# Altium schematic sheet Contactor_Switching.SchDoc
size A4; DocumentNumber: 7; SheetNumber: 7; SheetTotal: 8
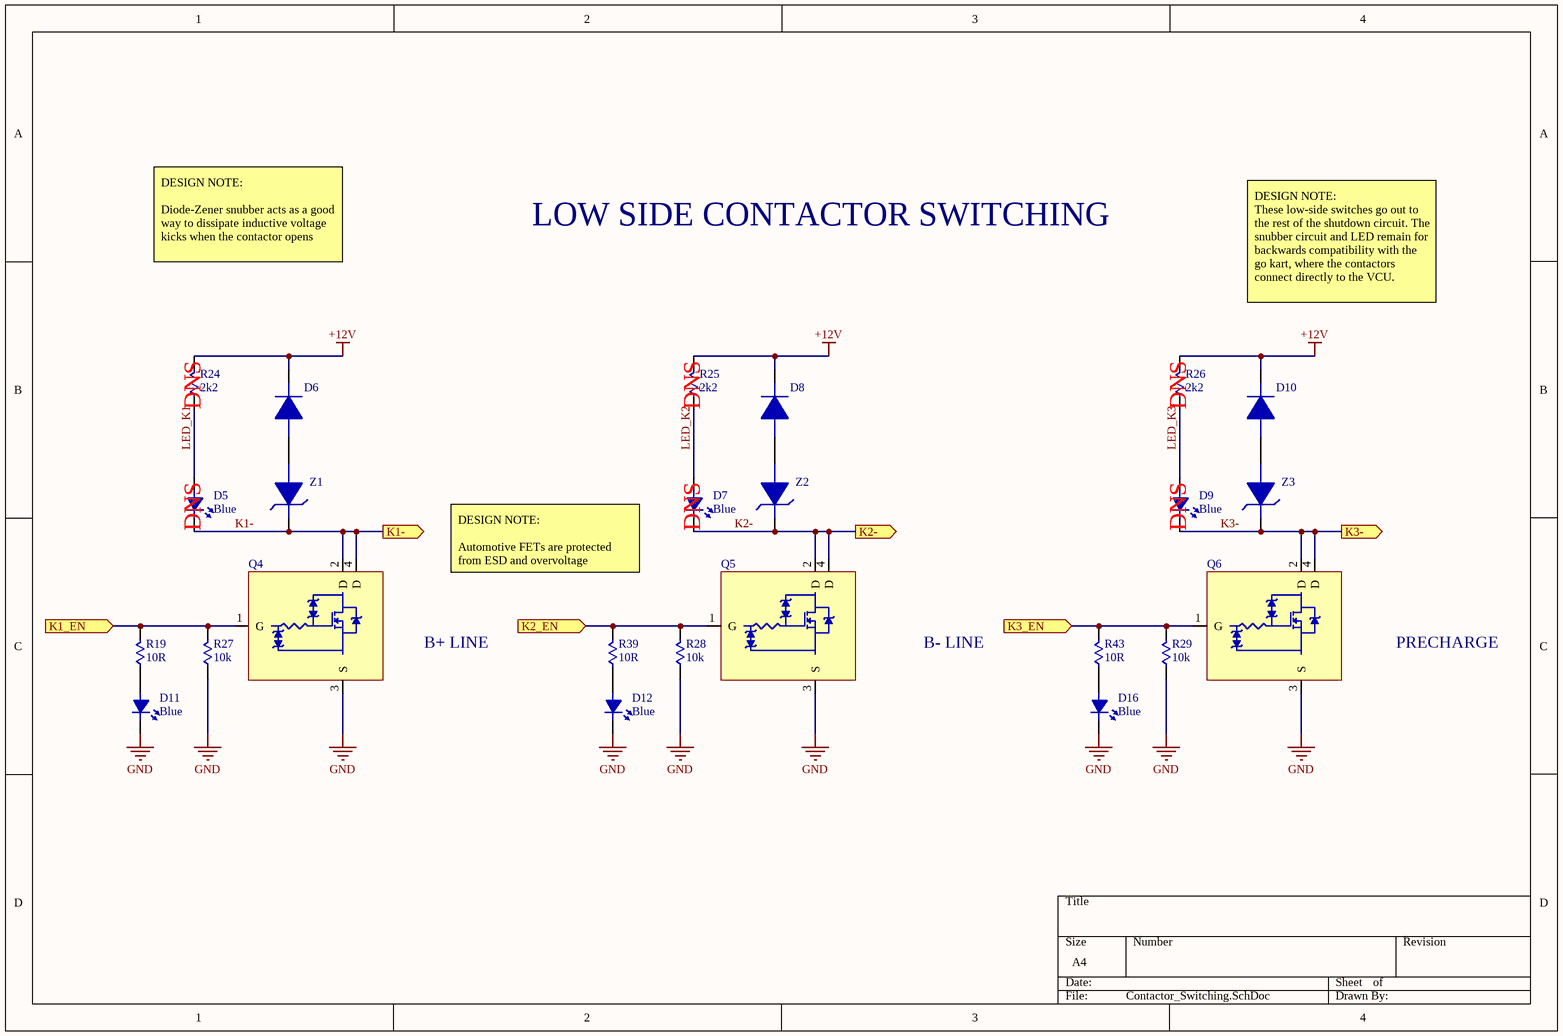
[diagram p0: Contactor_Switching.SchDoc]

## Parts
D5  Blue  [LED_0603]
D6  S3BB-TP  [DO-214AA_Diode]  (value not drawn)
D7  Blue  [LED_0603]
D8  S3BB-TP  [DO-214AA_Diode]  (value not drawn)
D9  Blue  [LED_0603]
D10  S3BB-TP  [DO-214AA_Diode]  (value not drawn)
D11  Blue  [LED_0603]
D12  Blue  [LED_0603]
D16  Blue  [LED_0603]
Q4  NCV8406ASTT1G  [SOT-223_NFET]  (value not drawn)
Q5  NCV8406ASTT1G  [SOT-223_NFET]  (value not drawn)
Q6  NCV8406ASTT1G  [SOT-223_NFET]  (value not drawn)
R19  10R  [R0402]
R24  2k2  [R0402]
R25  2k2  [R0402]
R26  2k2  [R0402]
R27  10k  [R0402]
R28  10k  [R0402]
R29  10k  [R0402]
R39  10R  [R0402]
R43  10R  [R0402]
Z1  12V  [DO-214AA_Diode]  (value not drawn)
Z2  12V  [DO-214AA_Diode]  (value not drawn)
Z3  12V  [DO-214AA_Diode]  (value not drawn)

## Ports
K1-, K1_EN, K2-, K2_EN, K3-, K3_EN

## Nets
+12V: D6.2 D8.2 D10.2 R24.2 R25.2 R26.2
GND: D11.2 D12.2 D16.2 Q4.3(S) Q5.3(S) Q6.3(S) R27.1 R28.1 R29.1
K1-: D5.2 Q4.2(D) Q4.4(D) Z1.2 ; port K1-
K1_EN: Q4.1(G) R19.2 R27.2 ; port K1_EN
K2-: D7.2 Q5.2(D) Q5.4(D) Z2.2 ; port K2-
K2_EN: Q5.1(G) R28.2 R39.2 ; port K2_EN
K3-: D9.2 Q6.2(D) Q6.4(D) Z3.2 ; port K3-
K3_EN: Q6.1(G) R29.2 R43.2 ; port K3_EN
LED_K1: D5.1 R24.1
LED_K2: D7.1 R25.1
LED_K3: D9.1 R26.1
NetD6_1: D6.1 Z1.1
NetD8_1: D8.1 Z2.1
NetD10_1: D10.1 Z3.1
NetD11_1: D11.1 R19.1
NetD12_1: D12.1 R39.1
NetD16_1: D16.1 R43.1

## Notes on the sheet
- LOW SIDE CONTACTOR SWITCHING
- DESIGN NOTE:
  Diode-Zener snubber acts as a good way to dissipate inductive voltage kicks when the contactor opens
- DESIGN NOTE:
  These low-side switches go out to the rest of the shutdown circuit. The snubber circuit and LED remain for backwards compatibility with the go kart, where the contactors connect directly to the VCU.
- (near R24) DNS
- (near R25) DNS
- (near R26) DNS
- (near D5) DNS
- DESIGN NOTE:
  Automotive FETs are protected from ESD and overvoltage
- (near D7) DNS
- (near D9) DNS
- B+ LINE
- B- LINE
- PRECHARGE

## Library data of the parts
D5 D7 D9 D11 D12 D16 = 150060BS75000: LED BLUE CLEAR 0603 SMD 3.2V 145MCD, 470NM; Manufacturer: Wurth Electronics; Forward Current: 30mA; Viewing Angle: 140°; Lens Style: Clear,Rectangular; Test Current: 20mA; Supplier 1: Digi-Key; Manufacturer Part Number: 150060BS75000; Stock 1: 59667; Pricing 1: 1=0.15, 50=0.141, 100=0.121, 500=0.104 (USD); Mount: Surface Mount; Case/Package: 0603; Color: Blue; Case Code (Metric): 1608; Case Code (Imperial): 0603; Min Operating Temperature: -40°C; Max Operating Temperature: 85°C; Luminous Intensity: 145mcd; Forward Voltage: 3.2V; Wavelength: 470nm; Package Quantity: 4000; Packaging: Cut Tape; Dominant Wavelength: 470nm; Length: 1.6mm; Height: 0.7mm; Width: 0.8mm; REACH SVHC: Unknown; ComponentLink1URL: https://www.distrelec.biz/Web/Downloads/_t/ds/150060BS75000_eng_tds.pdf?mime=application%2Fpdf; ComponentLink1Description: https://www.distrelec.biz/Web/Downloads/_t/ds/150060BS75000_eng_tds.pdf?mime=application%2Fpdf; ComponentLink2URL: https://katalog.we-online.de/led/datasheet/150060BS75000.pdf; ComponentLink2Description: https://katalog.we-online.de/led/datasheet/150060BS75000.pdf; ComponentLink3URL: http://www.farnell.com/datasheets/1911343.pdf; ComponentLink3Description: http://www.farnell.com/datasheets/1911343.pdf; ComponentLink4URL: http://www.produktinfo.conrad.com/datenblaetter/750000-774999/759426-da-01-en-CHIPLED_0603_W_KL_BLAU_150060BS75000.pdf; ComponentLink4Description: http://www.produktinfo.conrad.com/datenblaetter/750000-774999/759426-da-01-en-CHIPLED_0603_W_KL_BLAU_150060BS75000.pdf; Supplier Part Number 1: 732-4966-1-ND
D6 D8 D10 = S3BB-TP: DIODE GEN PURP 100V 3A DO214AA; Manufacturer: MCC; Max Surge Current: 100A; Forward Voltage: 1.15V; Peak Reverse Current: 10uA; Element Configuration: Single; Supplier 1: Digi-Key; Manufacturer Part Number: S3BB-TP; Stock 1: 10943; Pricing 1: 1=0.56, 10=0.441, 25=0.372, 100=0.3028, 250=0.2509, 500=0.2076, 1000=0.1557 (USD); Mount: Surface Mount; Number of Pins: 2; Packaging: Tape and Reel; Package Quantity: 1; Reverse Voltage (DC): 100V; Average Rectified Current: 3A; Peak Non-Repetitive Surge Current: 100A; Max Repetitive Reverse Voltage (Vrrm): 100V; Radiation Hardening: No; Lead Free: Lead Free; ComponentLink1URL: https://datasheet.ciiva.com/914/s3ab-s3mbsmb-914278.pdf; ComponentLink1Description: https://datasheet.ciiva.com/914/s3ab-s3mbsmb-914278.pdf; ComponentLink2URL: https://datasheet.ciiva.com/914/s3ab-s3mbsmb-914279.pdf; ComponentLink2Description: https://datasheet.ciiva.com/914/s3ab-s3mbsmb-914279.pdf; ComponentLink3URL: https://datasheet.ciiva.com/914/s3ab-s3mbsmb-914280.pdf; ComponentLink3Description: https://datasheet.ciiva.com/914/s3ab-s3mbsmb-914280.pdf; ComponentLink4URL: https://datasheet.ciiva.com/15200/getdatasheetpartid-686538-15200554.pdf; ComponentLink4Description: https://datasheet.ciiva.com/15200/getdatasheetpartid-686538-15200554.pdf; ComponentLink5URL: https://datasheet.ciiva.com/17437/s3ab-s3mbsmb-17437836.pdf; ComponentLink5Description: https://datasheet.ciiva.com/17437/s3ab-s3mbsmb-17437836.pdf; Supplier Part Number 1: S3BB-TPMSCT-ND
Q4-Q6 = NCV8406ASTT1G: MOSFET Self-Protected Low Side Driver Automotive 4-Pin(3+Tab) SOT-223 T/R; Manufacturer: ON Semiconductor; Number of Outputs: 1; Max Output Current: 7A; Interface: On/Off; On-State Resistance: 210mR; Fault Protection: Over Voltage,Over Temperature; Supplier 1: Digi-Key; Manufacturer Part Number: NCV8406ASTT1G; Stock 1: 277; Pricing 1: 1=1.41, 10=1.258, 100=0.981, 500=0.8104 (USD); Mount: Surface Mount; Case/Package: TO-261-4; Number of Pins: 4; Min Operating Temperature: -40°C; Max Operating Temperature: 150°C; Packaging: Tape and Reel; Package Quantity: 1000; Length: 6.5mm; Height: 1.57mm; Radiation Hardening: No; Lead Free: Lead Free; Halogen Free: Halogen Free; ComponentLink1URL: https://datasheet.ciiva.com/15265/htmls5-15265281.pdf; ComponentLink1Description: https://datasheet.ciiva.com/15265/htmls5-15265281.pdf; ComponentLink2URL: https://datasheet.ciiva.com/1956/ncv8406-d-1956280.pdf; ComponentLink2Description: https://datasheet.ciiva.com/1956/ncv8406-d-1956280.pdf; ComponentLink3URL: https://datasheet.ciiva.com/16217/ncv8406-d-16217275.pdf; ComponentLink3Description: https://datasheet.ciiva.com/16217/ncv8406-d-16217275.pdf; Supplier Part Number 1: NCV8406ASTT1GOSDKR-ND
R19 R39 R43 = RC0402JR-0710RL: RES SMD 10 OHM 5% 1/16W 0402; Manufacturer: Yageo; Power Rating: 63mW; Voltage Rating: 50V; Temperature Coefficient: 200ppm/°C; Supplier 1: Digi-Key; Manufacturer Part Number: RC0402JR-0710RL; Stock 1: 2958453; Pricing 1: 1=0.1, 10=0.019, 100=0.0079, 1000=0.0036, 2500=0.0031, 5000=0.0026 (USD); Case/Package: 0402; Case Code (Imperial): 0402; Case Code (Metric): 1005; Min Operating Temperature: -55°C; Max Operating Temperature: 155°C; Resistance: 10R; Tolerance: 5%; Packaging: Tape and Reel; Termination: SMD/SMT; Composition: Thick Film; Military Standard: Not; Package Quantity: 1; Number of Terminations: 2; Max Power Dissipation: 63mW; Working Voltage: 50V; Features: Moisture Resistant; Length: 1mm; Height: 0.016inch; Depth: 0.5mm; Width: 0.02inch; REACH SVHC: Unknown; Lead Free: Lead Free; ComponentLink1URL: http://www.farnell.com/datasheets/1018594.pdf; ComponentLink1Description: http://www.farnell.com/datasheets/1018594.pdf; ComponentLink2URL: http://www.yageo.com/documents/recent/PYu-RC_Group_51_RoHS_L_10.pdf; ComponentLink2Description: http://www.yageo.com/documents/recent/PYu-RC_Group_51_RoHS_L_10.pdf; ComponentLink3URL: http://www.yageo.com/documents/recent/PYu-RC0402_51_RoHS_L_6_r.pdf; ComponentLink3Description: http://www.yageo.com/documents/recent/PYu-RC0402_51_RoHS_L_6_r.pdf; Supplier Part Number 1: 311-10JRCT-ND
R24-R26 = RC0402JR-072K2L: RES SMD 2.2K OHM 5% 1/16W 0402; Manufacturer: Yageo; Resistance: 2.2kR; Power Rating: 63mW; Voltage Rating: 50V; Temperature Coefficient: 100ppm/°C; Supplier 1: Digi-Key; Manufacturer Part Number: RC0402JR-072K2L; Stock 1: 7890813; Pricing 1: 1=0.1, 10=0.018, 100=0.0073, 1000=0.0033, 2500=0.0029, 5000=0.0024 (USD); Case/Package: 0402; Weight: 2.3E-05oz; Case Code (Metric): 1005; Case Code (Imperial): 0402; Min Operating Temperature: -55°C; Max Operating Temperature: 155°C; Tolerance: 5%; Packaging: Tape and Reel; Composition: Thick Film; Termination: SMD/SMT; Military Standard: Not; Package Quantity: 1; Number of Terminations: 2; Max Power Dissipation: 63mW; Working Voltage: 50V; Features: Moisture Resistant; Length: 1mm; Height: 0.016inch; Depth: 0.5mm; Width: 0.02inch; REACH SVHC: Unknown; Lead Free: Lead Free; Supplier Part Number 1: 311-2.2KJRCT-ND
R27-R29 = RC0402JR-0710KL: RES SMD 10K OHM 5% 1/16W 0402; Manufacturer: Yageo; Resistance: 10kR; Power Rating: 62.5mW; Voltage Rating: 50V; Temperature Coefficient: 100ppm/°C; Max Power Dissipation: 63mW; Supplier 1: Digi-Key; Manufacturer Part Number: RC0402JR-0710KL; Stock 1: 47303622; Pricing 1: 1=0.1, 10=0.018, 100=0.0073, 1000=0.0033, 2500=0.0029, 5000=0.0024 (USD); Case/Package: 0402; Case Code (Metric): 1005; Case Code (Imperial): 0402; Min Operating Temperature: -55°C; Max Operating Temperature: 155°C; Packaging: Tape and Reel; Tolerance: 5%; Package Quantity: 1; Composition: Thick Film; Number of Terminations: 2; Termination: SMD/SMT; Military Standard: Not; Features: Moisture Resistant; Length: 1mm; Height: 0.016inch; Width: 0.02inch; Depth: 0.5mm; REACH SVHC: Unknown; Lead Free: Lead Free; Supplier Part Number 1: 311-10KJRCT-ND
Z1-Z3 = SMBJ5349B-TP: DIODE ZENER 12V 5W DO214AA; Manufacturer: MCC; Tolerance: 5%; Forward Voltage: 1.2V; Max Reverse Leakage Current: 2uA; Impedance: 2.5R; Zener Current: 395mA; Test Current: 100mA; Element Configuration: Single; Supplier 1: Digi-Key; Manufacturer Part Number: SMBJ5349B-TP; Stock 1: 41768; Pricing 1: 1=0.65, 10=0.57, 25=0.5044, 100=0.4394, 250=0.3824, 500=0.3255, 1000=0.2604 (USD); Mount: Surface Mount; Case/Package: SMB; Number of Pins: 2; Min Operating Temperature: -55°C; Max Operating Temperature: 150°C; Package Quantity: 3000; Packaging: Tape and Reel; Power Dissipation: 5W; Zener Voltage: 12V; Voltage Tolerance: 5%; Max Power Dissipation: 5W; Working Voltage: 12V; Peak Reverse Current: 2uA; Radiation Hardening: No; Lead Free: Lead Free; ComponentLink1URL: https://datasheet.ciiva.com/894/smbj5338b-smbj5388bsmb-894182.pdf; ComponentLink1Description: https://datasheet.ciiva.com/894/smbj5338b-smbj5388bsmb-894182.pdf; ComponentLink2URL: https://datasheet.ciiva.com/894/smbj5338b-smbj5388bsmb-894183.pdf; ComponentLink2Description: https://datasheet.ciiva.com/894/smbj5338b-smbj5388bsmb-894183.pdf; ComponentLink3URL: https://datasheet.ciiva.com/894/smbj5338b-smbj5388bsmb-894184.pdf; ComponentLink3Description: https://datasheet.ciiva.com/894/smbj5338b-smbj5388bsmb-894184.pdf; ComponentLink4URL: https://datasheet.ciiva.com/17444/smbj5338b-smbj5388bsmb-17444298.pdf; ComponentLink4Description: https://datasheet.ciiva.com/17444/smbj5338b-smbj5388bsmb-17444298.pdf; ComponentLink5URL: https://datasheet.ciiva.com/26844/getdatasheetpartid-147575-26844923.pdf; ComponentLink5Description: https://datasheet.ciiva.com/26844/getdatasheetpartid-147575-26844923.pdf; Supplier Part Number 1: SMBJ5349B-TPMSDKR-ND